# Altium schematic sheet Block Diagram.SchDoc: Block Diagram
size 393 x 292 mm; SheetNumber: 1; SheetTotal: 40
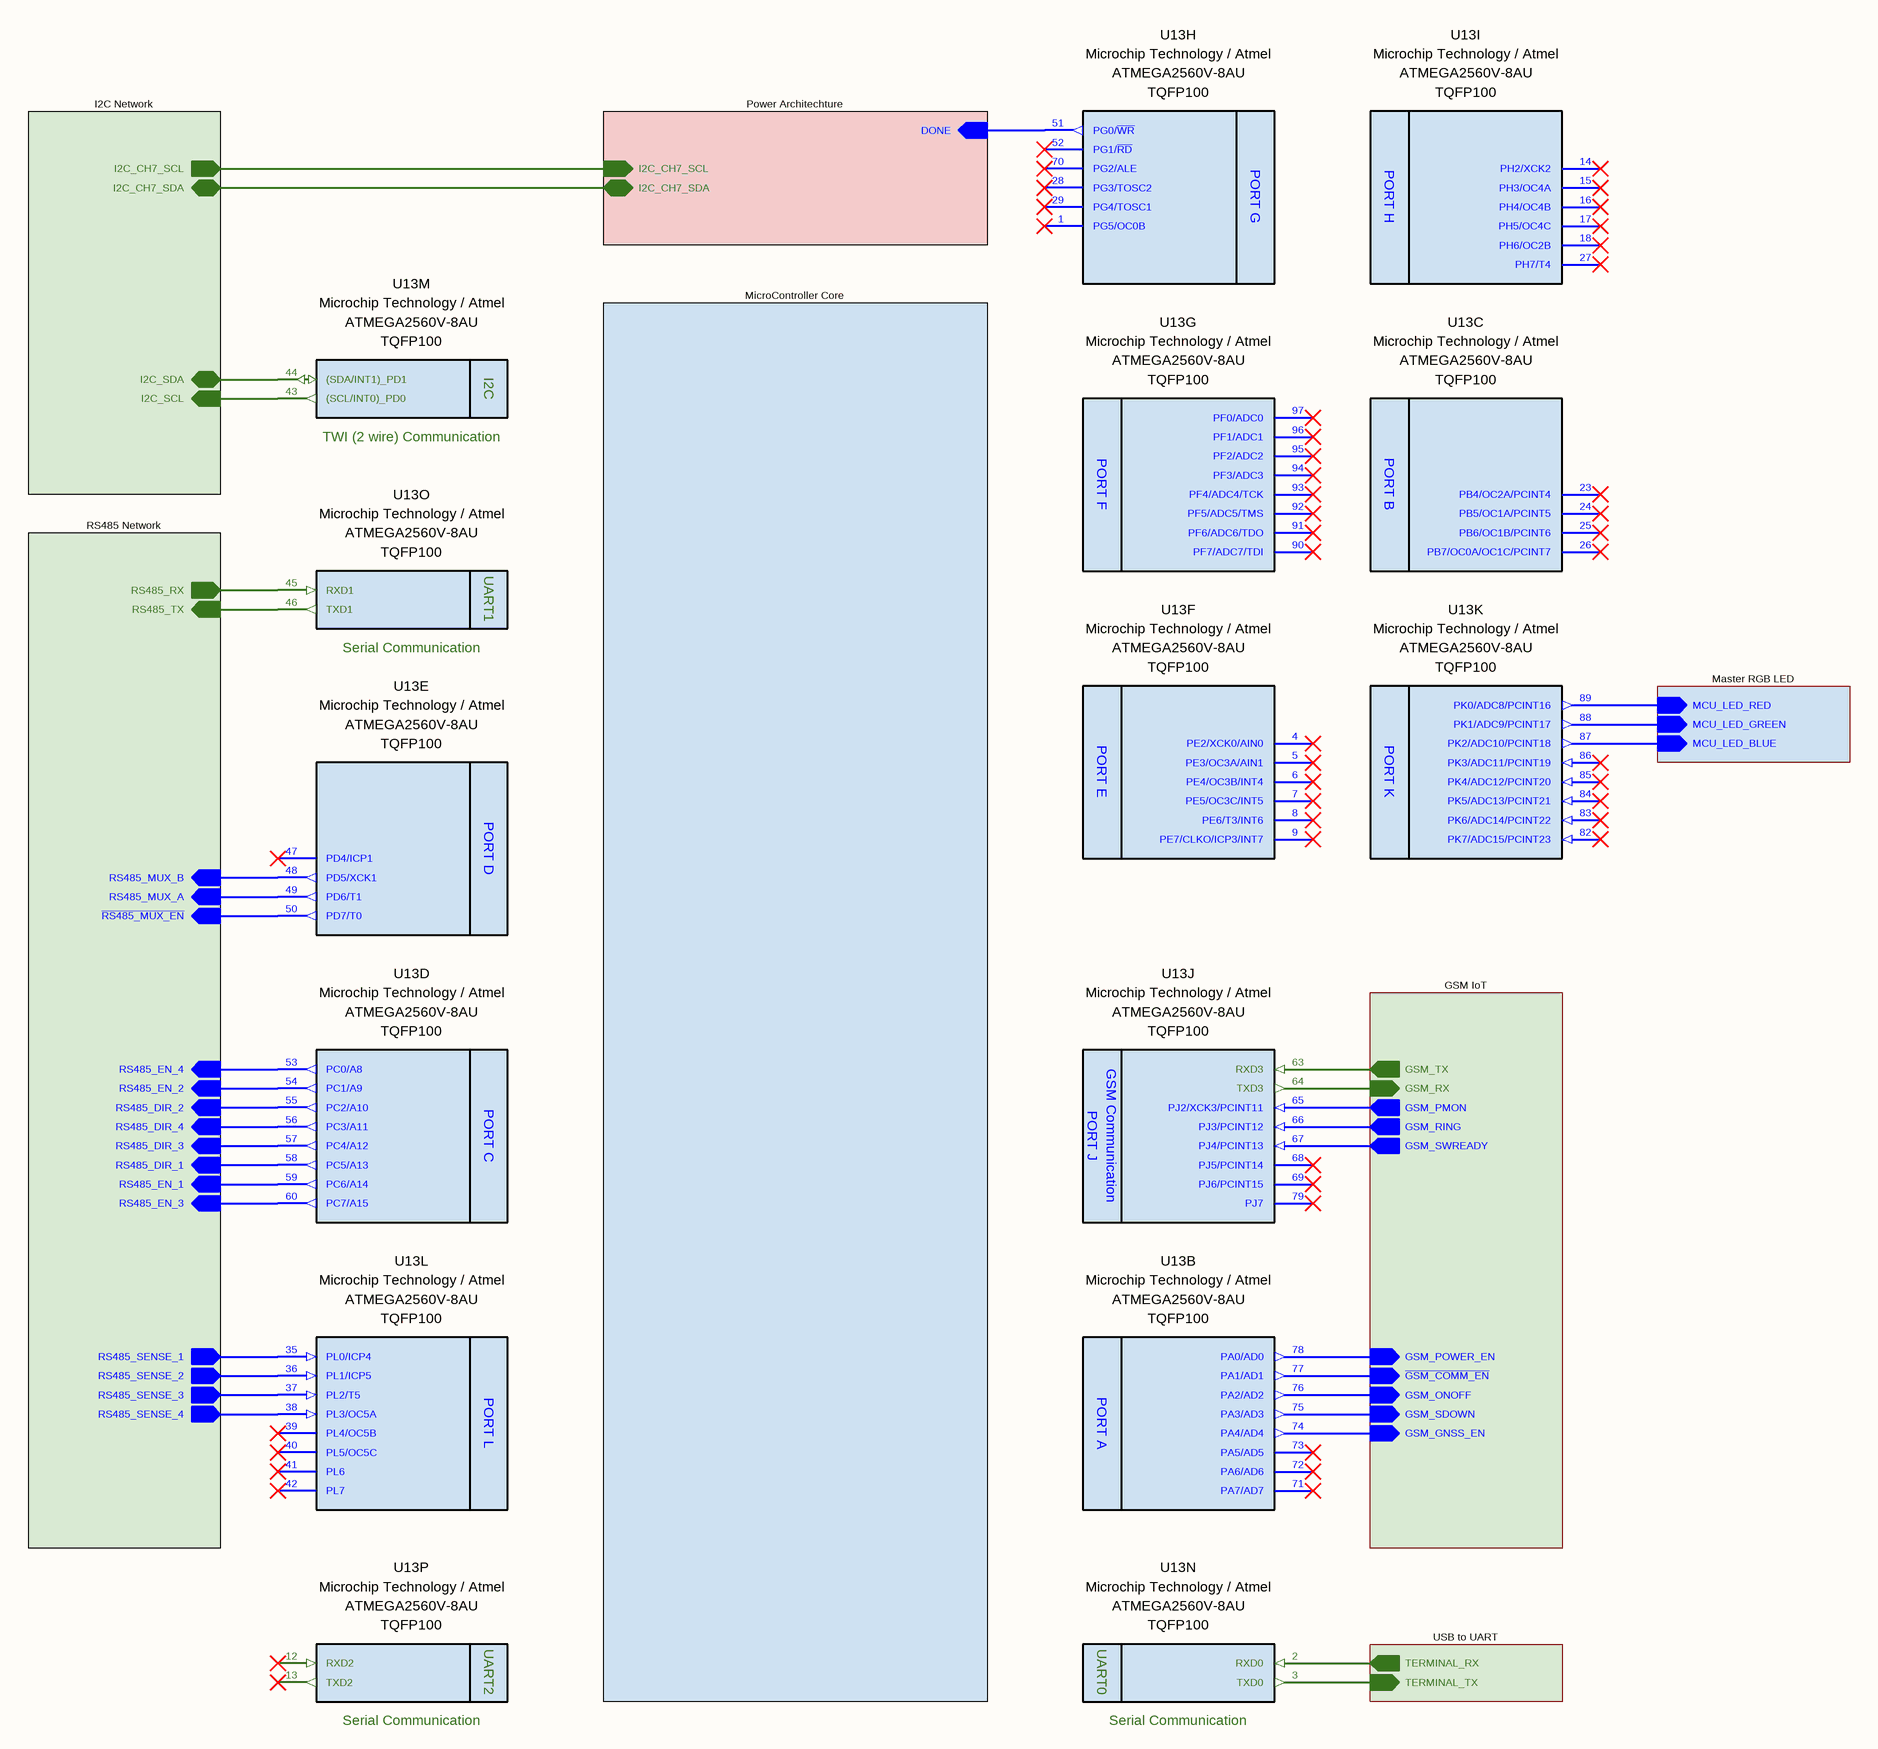
[diagram p0: Block Diagram.SchDoc]

## Parts
U13  Manufacturer Name: Microchip Technology / Atmel  Case: TQFP100  [TQFP-100]  (hidden comment: ATMEGA2560V-8AU)  (parts B,C,D,E,F,G,H,I,J,K,L,M,N,O,P of 18)

## Sub-sheets
GSM IoT = GSM IoT Block Diagram.SchDoc: GSM_ONOFF (in), GSM_SDOWN (in), GSM_GNSS_EN (in), GSM_PMON (out), GSM_SWREADY (out), GSM_RING (out), ~{GSM_COMM_EN} (in), GSM_TX (out), GSM_RX (in), GSM_POWER_EN (in)
I2C Network = I2C Network.SchDoc: I2C_CH7_SDA (bidir), I2C_CH7_SCL (out), I2C_SDA (bidir), I2C_SCL (in)
Master RGB LED = MicroController RGB LED.SchDoc: MCU_LED_RED (in), MCU_LED_GREEN (in), MCU_LED_BLUE (in)
MicroController Core = MicroController Core.SchDoc: no entries
Power Architechture = Power Architechture.SchDoc: DONE (in), I2C_CH7_SDA (bidir), I2C_CH7_SCL (in)
RS485 Network = RS485 Outputs.SchDoc: RS485_EN_1 (in), RS485_SENSE_1 (out), RS485_DIR_1 (in), RS485_EN_2 (in), RS485_SENSE_2 (out), RS485_DIR_2 (in), RS485_EN_3 (in), RS485_SENSE_3 (out), RS485_DIR_3 (in), RS485_EN_4 (in), RS485_SENSE_4 (out), RS485_DIR_4 (in), ~{RS485_MUX_EN} (in), RS485_MUX_A (in), RS485_MUX_B (in), RS485_TX (in), RS485_RX (out)
USB to UART = MicroController USB to UART Converter.SchDoc: TERMINAL_TX (in), TERMINAL_RX (out)

## Nets
NetU13_2: U13.2(RXD0) ; sheet USB to UART/TERMINAL_RX
NetU13_3: U13.3(TXD0) ; sheet USB to UART/TERMINAL_TX
NetU13_35: U13.35(PL0/ICP4) ; sheet RS485 Network/RS485_SENSE_1
NetU13_36: U13.36(PL1/ICP5) ; sheet RS485 Network/RS485_SENSE_2
NetU13_37: U13.37(PL2/T5) ; sheet RS485 Network/RS485_SENSE_3
NetU13_38: U13.38(PL3/OC5A) ; sheet RS485 Network/RS485_SENSE_4
NetU13_43: U13.43((SCL/INT0)_PD0) ; sheet I2C Network/I2C_SCL
NetU13_44: U13.44((SDA/INT1)_PD1) ; sheet I2C Network/I2C_SDA
NetU13_45: U13.45(RXD1) ; sheet RS485 Network/RS485_RX
NetU13_46: U13.46(TXD1) ; sheet RS485 Network/RS485_TX
NetU13_48: U13.48(PD5/XCK1) ; sheet RS485 Network/RS485_MUX_B
NetU13_49: U13.49(PD6/T1) ; sheet RS485 Network/RS485_MUX_A
NetU13_50: U13.50(PD7/T0) ; sheet RS485 Network/~{RS485_MUX_EN}
NetU13_51: U13.51(PG0/~{WR}) ; sheet Power Architechture/DONE
NetU13_53: U13.53(PC0/A8) ; sheet RS485 Network/RS485_EN_4
NetU13_54: U13.54(PC1/A9) ; sheet RS485 Network/RS485_EN_2
NetU13_55: U13.55(PC2/A10) ; sheet RS485 Network/RS485_DIR_2
NetU13_56: U13.56(PC3/A11) ; sheet RS485 Network/RS485_DIR_4
NetU13_57: U13.57(PC4/A12) ; sheet RS485 Network/RS485_DIR_3
NetU13_58: U13.58(PC5/A13) ; sheet RS485 Network/RS485_DIR_1
NetU13_59: U13.59(PC6/A14) ; sheet RS485 Network/RS485_EN_1
NetU13_60: U13.60(PC7/A15) ; sheet RS485 Network/RS485_EN_3
NetU13_63: U13.63(RXD3) ; sheet GSM IoT/GSM_TX
NetU13_64: U13.64(TXD3) ; sheet GSM IoT/GSM_RX
NetU13_65: U13.65(PJ2/XCK3/PCINT11) ; sheet GSM IoT/GSM_PMON
NetU13_66: U13.66(PJ3/PCINT12) ; sheet GSM IoT/GSM_RING
NetU13_67: U13.67(PJ4/PCINT13) ; sheet GSM IoT/GSM_SWREADY
NetU13_74: U13.74(PA4/AD4) ; sheet GSM IoT/GSM_GNSS_EN
NetU13_75: U13.75(PA3/AD3) ; sheet GSM IoT/GSM_SDOWN
NetU13_76: U13.76(PA2/AD2) ; sheet GSM IoT/GSM_ONOFF
NetU13_77: U13.77(PA1/AD1) ; sheet GSM IoT/~{GSM_COMM_EN}
NetU13_78: U13.78(PA0/AD0) ; sheet GSM IoT/GSM_POWER_EN
NetU13_87: U13.87(PK2/ADC10/PCINT18) ; sheet Master RGB LED/MCU_LED_BLUE
NetU13_88: U13.88(PK1/ADC9/PCINT17) ; sheet Master RGB LED/MCU_LED_GREEN
NetU13_89: U13.89(PK0/ADC8/PCINT16) ; sheet Master RGB LED/MCU_LED_RED
(unnamed): sheet I2C Network/I2C_CH7_SDA, sheet Power Architechture/I2C_CH7_SDA
(unnamed): sheet I2C Network/I2C_CH7_SCL, sheet Power Architechture/I2C_CH7_SCL

Not connected (* = marked no-connect by the designer): U13 1(PG5/OC0B)* 4(PE2/XCK0/AIN0)* 5(PE3/OC3A/AIN1)* 6(PE4/OC3B/INT4)* 7(PE5/OC3C/INT5)* 8(PE6/T3/INT6)* 9(PE7/CLKO/ICP3/INT7)* 12(RXD2)* 13(TXD2)* 14(PH2/XCK2)* 15(PH3/OC4A)* 16(PH4/OC4B)* 17(PH5/OC4C)* 18(PH6/OC2B)* 23(PB4/OC2A/PCINT4)* 24(PB5/OC1A/PCINT5)* 25(PB6/OC1B/PCINT6)* 26(PB7/OC0A/OC1C/PCINT7)* 27(PH7/T4)* 28(PG3/TOSC2)* 29(PG4/TOSC1)* 39(PL4/OC5B)* 40(PL5/OC5C)* 41(PL6)* 42(PL7)* 47(PD4/ICP1)* 52(PG1/~{RD})* 68(PJ5/PCINT14)* 69(PJ6/PCINT15)* 70(PG2/ALE)* 71(PA7/AD7)* 72(PA6/AD6)* 73(PA5/AD5)* 79(PJ7)* 82(PK7/ADC15/PCINT23)* 83(PK6/ADC14/PCINT22)* 84(PK5/ADC13/PCINT21)* 85(PK4/ADC12/PCINT20)* 86(PK3/ADC11/PCINT19)* 90(PF7/ADC7/TDI)* 91(PF6/ADC6/TDO)* 92(PF5/ADC5/TMS)* 93(PF4/ADC4/TCK)* 94(PF3/ADC3)* 95(PF2/ADC2)* 96(PF1/ADC1)* 97(PF0/ADC0)*

## Notes on the sheet
- © 2022 All rights reserved.
  This document may not, in whole or in part, be copied, photocopied, reproduced, translated or converted to any electronic or machine readable from without prior written permission of Mehmet Günce Akkoyun.
  Engineer contact : akkoyun@me.com
- Property of
- Engineer :
- Date :
- Size :
- A3
- Time :
- Project :
- Page :
- /
- Customer :
- Product ID :
- Module ID :
- Version :
- File :
- Revision :
- (in symbol IC - AtMega2560V-8AU, part B) PORT A
- (in symbol IC - AtMega2560V-8AU, part C) PORT B
- (in symbol IC - AtMega2560V-8AU, part D) PORT C
- (in symbol IC - AtMega2560V-8AU, part E) PORT D
- (in symbol IC - AtMega2560V-8AU, part F) PORT E
- (in symbol IC - AtMega2560V-8AU, part G) PORT F
- (in symbol IC - AtMega2560V-8AU, part H) PORT G
- (in symbol IC - AtMega2560V-8AU, part I) PORT H
- (in symbol IC - AtMega2560V-8AU, part J) PORT J; GSM Communication
- (in symbol IC - AtMega2560V-8AU, part K) PORT K
- (in symbol IC - AtMega2560V-8AU, part L) PORT L
- (in symbol IC - AtMega2560V-8AU, part M) I2C; TWI (2 wire) Communication
- (in symbol IC - AtMega2560V-8AU, part N) UART0; Serial Communication
- (in symbol IC - AtMega2560V-8AU, part O) UART1; Serial Communication
- (in symbol IC - AtMega2560V-8AU, part P) UART2; Serial Communication

## Library data of the parts
U13 = IC - AtMega2560V-8AU: ATmega Series 256 KB Flash 8 KB SRAM 8 MHz 8-Bit Microcontroller - TQFP-100; Program Memory Size: 256 kB; Core: AVR; Operating Supply Voltage: 2.7 V to 5.5 V; Maximum Clock Frequency: 8 MHz; Maximum Operating Temperature: + 85 C; Product Type: MicroControllers; Minimum Operating Temperature: - 40 C; Manufacturer Part Number: ATMEGA2560V-8AU